# Altium schematic sheet InPortIndication.SchDoc
size A4
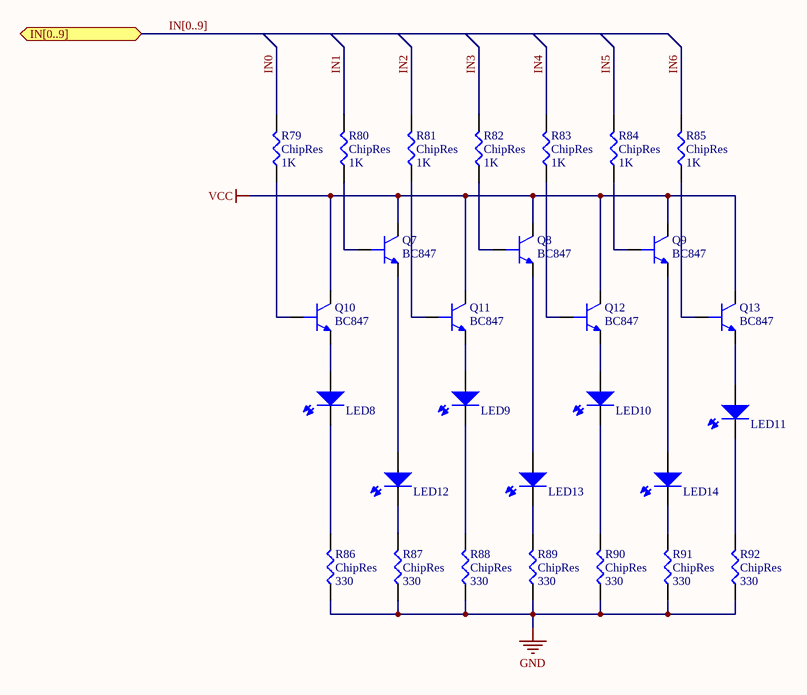
[diagram p0: InPortIndication.SchDoc]

## Parts
LED8  LED 0603  [LED 0603]  (value not drawn)
LED9  LED 0603  [LED 0603]  (value not drawn)
LED10  LED 0603  [LED 0603]  (value not drawn)
LED11  LED 0603  [LED 0603]  (value not drawn)
LED12  LED 0603  [LED 0603]  (value not drawn)
LED13  LED 0603  [LED 0603]  (value not drawn)
LED14  LED 0603  [LED 0603]  (value not drawn)
Q7  BC847  [SOT23]
Q8  BC847  [SOT23]
Q9  BC847  [SOT23]
Q10  BC847  [SOT23]
Q11  BC847  [SOT23]
Q12  BC847  [SOT23]
Q13  BC847  [SOT23]
R79  ChipRes  value 1K  [RES0805]
R80  ChipRes  value 1K  [RES0805]
R81  ChipRes  value 1K  [RES0805]
R82  ChipRes  value 1K  [RES0805]
R83  ChipRes  value 1K  [RES0805]
R84  ChipRes  value 1K  [RES0805]
R85  ChipRes  value 1K  [RES0805]
R86  ChipRes  value 330  [RES0805]
R87  ChipRes  value 330  [RES0805]
R88  ChipRes  value 330  [RES0805]
R89  ChipRes  value 330  [RES0805]
R90  ChipRes  value 330  [RES0805]
R91  ChipRes  value 330  [RES0805]
R92  ChipRes  value 330  [RES0805]

## Ports
IN[0..9]

## Nets
GND: R86.1 R87.1 R88.1 R89.1 R90.1 R91.1 R92.1
VCC: Q7.3 Q8.3 Q9.3 Q10.3 Q11.3 Q12.3 Q13.3
IN0: R79.2
IN1: R80.2
IN2: R81.2
IN3: R82.2
IN4: R83.2
IN5: R84.2
IN6: R85.2
NetLED8_1: LED8.1 R86.2
NetLED8_2: LED8.2 Q10.2
NetLED9_1: LED9.1 R88.2
NetLED9_2: LED9.2 Q11.2
NetLED10_1: LED10.1 R90.2
NetLED10_2: LED10.2 Q12.2
NetLED11_1: LED11.1 R92.2
NetLED11_2: LED11.2 Q13.2
NetLED12_1: LED12.1 R87.2
NetLED12_2: LED12.2 Q7.2
NetLED13_1: LED13.1 R89.2
NetLED13_2: LED13.2 Q8.2
NetLED14_1: LED14.1 R91.2
NetLED14_2: LED14.2 Q9.2
NetQ7_1: Q7.1 R80.1
NetQ8_1: Q8.1 R82.1
NetQ9_1: Q9.1 R84.1
NetQ10_1: Q10.1 R79.1
NetQ11_1: Q11.1 R81.1
NetQ12_1: Q12.1 R83.1
NetQ13_1: Q13.1 R85.1

## Buses and harness runs
bus IN[0..9] = port IN[0..9]

## Library data of the parts
LED8-LED14 = LED0603
Q7-Q13 = BC847: NPN transistor
R79-R92 = ChipRes: Chip resistor